# Altium project RD_PCB.PrjPcb
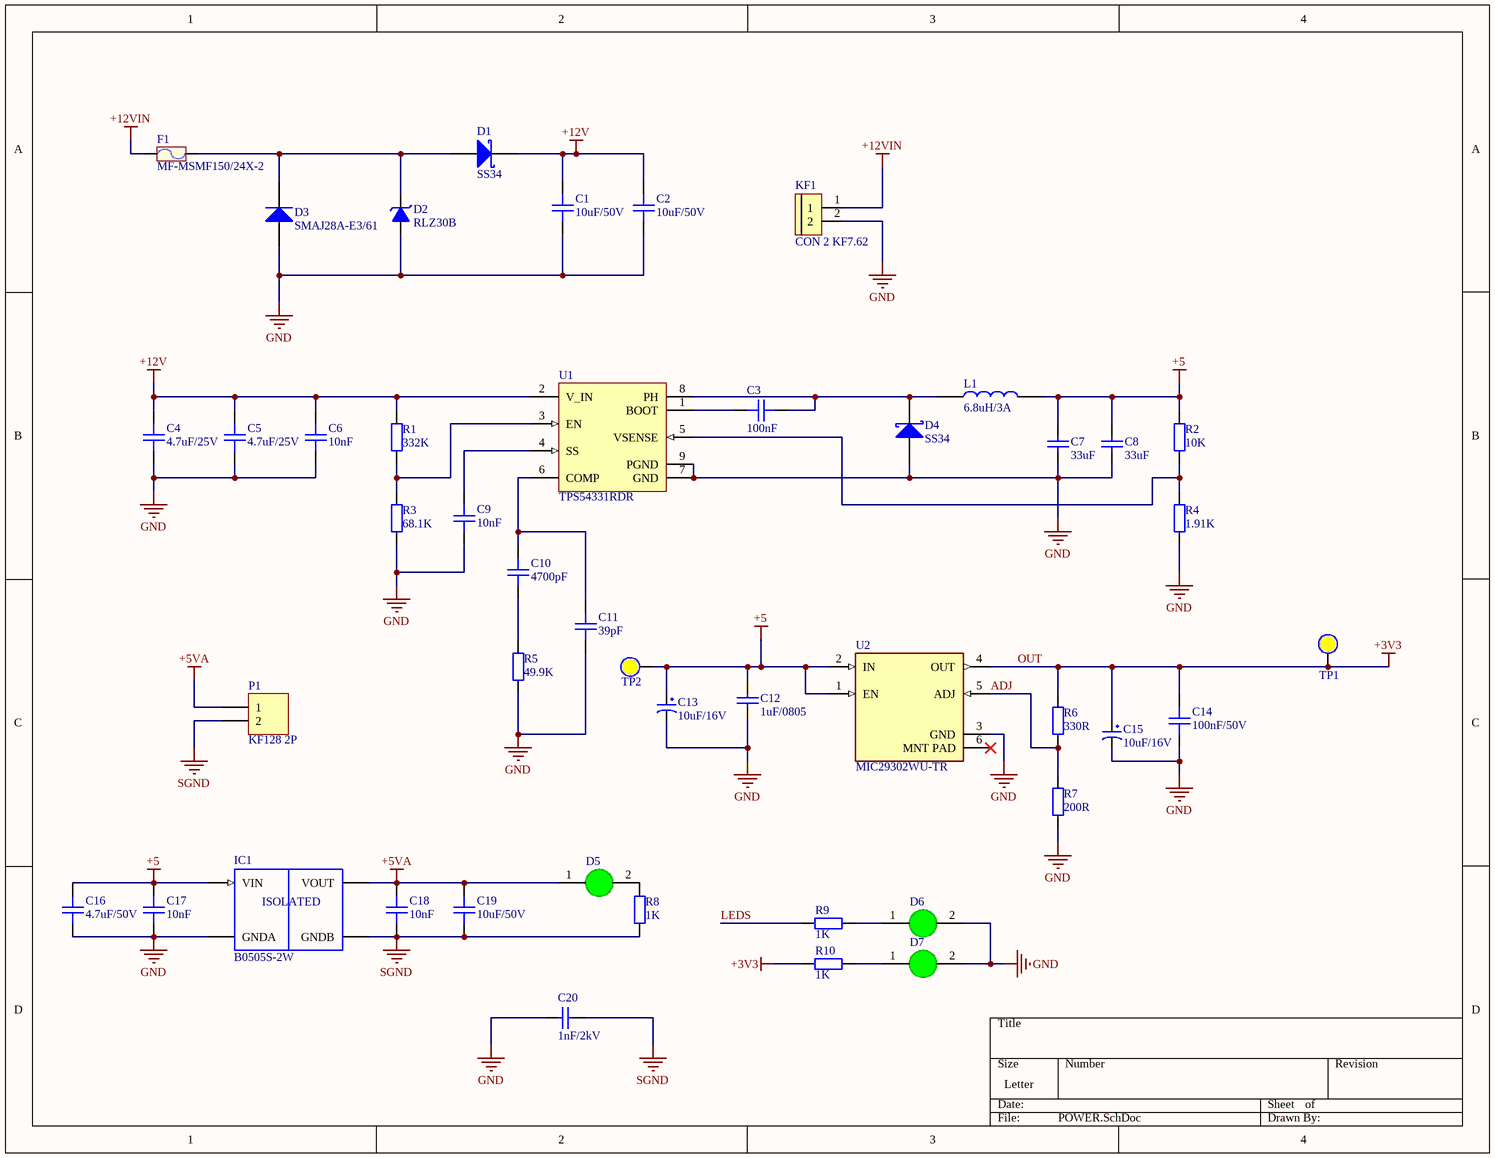
[diagram p0: POWER.SchDoc]
4 sheets, 123 parts. Net scope: global (net labels, ports and power ports of the same name join across sheets).
Board file: RD_PCB_TEST.PcbDoc
Sheets:
  POWER.SchDoc
  MCU.SchDoc
  ETHERNET.SchDoc
  OUTPUT.SchDoc

## Sheet POWER.SchDoc
size Letter; SheetNumber: 1; SheetTotal: 4

### Parts
C1  10uF/50V  [1210]
C2  10uF/50V  [1210]
C3  100nF  [CAPC-0603 (1608)]
C4  4.7uF/25V  [CAPC-1210 (3225)]
C5  4.7uF/25V  [CAPC-1210 (3225)]
C6  10nF  [CAPC-0603 (1608)]
C7  33uF  [tu 1206]
C8  33uF  [tu 1206]
C9  10nF  [CAPC-0603 (1608)]
C10  4700pF  [CAPC-0603 (1608)]
C11  39pF  [CAPC-0603 (1608)]
C12  1uF/0805  [tu 0805]
C13  10uF/16V  [2312]
C14  100nF/50V  [C0805]
C15  10uF/16V  [2312]
C16  4.7uF/50V  [CAPC-0805 (2012)]
C17  10nF  [CAPC-0603 (1608)]
C18  10nF  [CAPC-0603 (1608)]
C19  10uF/50V  [CAPC-0805 (2012)]
C20  1nF/2kV  [tu 1206]
D1  SS34  [DIODE_DO214AC_SMA]
D2  RLZ30B  [SOD_80]
D3  SMAJ28A-E3/61  [VISH-DO-214AC-2_L]
D4  SS34  [DIODE_DO214AC_SMA]
D5  (no value)  [LED_0805_GREEN]
D6  (no value)  [LED_0805_GREEN]
D7  (no value)  [LED_0805_GREEN]
F1  MF-MSMF150/24X-2  [1812]
IC1  B0505S-2W  [B0505S-2W]
KF1  CON 2 KF7.62  [CON 2 KF7.62]
L1  6.8uH/3A  [Cuon Cam 12x12x10]
P1  KF128 2P  [KF128_2P]
R1  332K  [RESC-0603 (1608)]
R2  10K  [RESC-0805 (2012)]
R3  68.1K  [RESC-0603 (1608)]
R4  1.91K  [RESC-0805 (2012)]
R5  49.9K  [RESC-0603 (1608)]
R6  330R  [RESC-0805 (2012)]
R7  200R  [RESC-0805 (2012)]
R8  1K  [RESC-0805 (2012)]
R9  1K  [RESC-0805 (2012)]
R10  1K  [RESC-0805 (2012)]
TP1  (no value)  [Test Point 1 MM]  (no BOM)
TP2  (no value)  [Test Point 1 MM]  (no BOM)
U1  TPS54331RDR  [SOIC-8-TP]
U2  MIC29302WU-TR  [FP-C04-012-MFG]

### Nets
+5: C7.1 C8.1 C12.1 C13.1 C16.2 C17.2 IC1.VIN L1.2 R2.2 TP2.0 U2.1(EN) U2.2(IN)
+5VA: C18.2 C19.2 D5.1(A) IC1.VOUT P1.1
+12V: C1.2 C2.2 C4.2 C5.2 C6.2 D1.2(K) R1.2 U1.2(V_IN)  [project net +LED]
+12VIN: F1.1 KF1.1
GND: C1.1 C2.1 C4.1 C5.1 C6.1 C7.2 C8.2 C9.1 C11.1 C12.2 C13.2 C14.1 C15.2 C16.1 C17.1 C20.2 D2.1(A) D3.2(A) D4.1(A) D6.2(K) D7.2(K) IC1.GNDA KF1.2 R3.1 R4.1 R5.1 R7.1 U1.7(GND) U1.9(PGND) U2.3(GND)
OUT: C14.2 C15.1 R6.2 R10.1 TP1.0 U2.4(OUT)  [also labelled +3V3]
SGND: C18.1 C19.1 C20.1 IC1.GNDB P1.2 R8.2
ADJ: R6.1 R7.2 U2.5(ADJ)
LEDS: R9.1
NetC3_1: C3.1 U1.1(BOOT)
NetC3_2: C3.2 D4.2(K) L1.1 U1.8(PH)
NetC9_2: C9.2 U1.4(SS)
NetC10_1: C10.1 R5.2
NetC10_2: C10.2 C11.2 U1.6(COMP)
NetD1_1: D1.1(A) D2.2(K) D3.1(K) F1.2
NetD5_2: D5.2(K) R8.1
NetD6_1: D6.1(A) R9.2
NetD7_1: D7.1(A) R10.2
NetR1_1: R1.1 R3.2 U1.3(EN)
NetR2_1: R2.1 R4.2 U1.5(VSENSE)

Not connected (* = marked no-connect by the designer): U2 6(MNT_PAD)*

### Notes on the sheet
- (in symbol B0505S-2W) ISOLATED

### Library data of the parts
C1 C2 = CAP_CER_1210_10uF: CAP CER 10uF/50V 1210; Manufacturer: Yageo; Part number: C1210; Cost: 3400; ComponentLink1Description: Link product; ComponentLink1URL: https://www.thegioiic.com/tu-gom-1210-10uf-50v; Package: 1210
C3 = CC0603ZRY5V9BB224: CAP CER 0.22UF 50V Y5V 0603; Value: 224/50V; Solder: SMT; MPN: CC0603ZRY5V9BB224; Category: CAPACITOR; PinCount: 2
C4 C5 = CC1210KKX7R9BB105: CAP CER 1UF 50V X7R 1210; MFR: Yageo; Value: 105/50V; Solder: SMT; MPN: CC1210KKX7R9BB105; Category: CAPACITOR; PinCount: 2
C6 C9 C17 C18 = CC0603KRX7R7BB103: CAP CER 10nF 16V 10% X7R 0603; CompanyID: VT-00592; Solder: SMT; Value: 103/16V; MPN: CC0603KRX7R7BB103; Category: CAPACITOR; PinCount: 2
C7 C8 = Tu 1206 100pF 50V 5%: Dán; Don_Vi: Con; So_Chan: 2; Ten_Linh_Kien: Tụ 1206 100P 5% 50V; Ma_Hang: MH008101; Chung_Loai: Dán; Kieu_Chan: *
C10 = CC0603KRX7R9BB822: CAP CER 8200PF 50V X7R 0603; MFR: Yageo; Value: 822/50V; Solder: SMT; MPN: CC0603KRX7R9BB822; Category: CAPACITOR; PinCount: 2
C11 = CC0603JRNPO9BN560: CAP CER 56PF 50V 5% COG/NPO 0603; Solder: SMT; CompanyID: VT-00150; Value: 56pF/50V; MPN: CC0603JRNPO9BN560; Category: CAPACITOR; PinCount: 2
C12 = Tu 0805 104 50V 10%: Dán; Don_Vi: Con; So_Chan: 2; Ten_Linh_Kien: Tụ 0805 104-100nF 10% 50V; Ma_Hang: MH004551; Chung_Loai: Dán; Kieu_Chan: *; ComponentLink1Description: New link; ComponentLink1URL: https://www.thegioiic.com/tu-gom-0805-1uf-25v
C13 C15 = CAP_TANT_2312_100uF: CAP TANT 100uF/10V 2312; Manufacturer: AVX; Part number: TAJC107K010RNJ; Cost: 5000; ComponentLink1Description: Link product; ComponentLink1URL: https://www.thegioiic.com/tu-tantalum-100uf-10v-2312-tajc107k010rnj; Package: 2312
C14 = CAP_CER_0805_100nF: CAP CER 100nF/50V 0805; Manufacturer: Samsung; Cost: 190; Part number: C0805; ComponentLink1Description: Link product; ComponentLink1URL: https://www.thegioiic.com/tu-gom-0805-100nf-0-1uf-50v; Package: 0805
C16 = CC0805ZRY5V6BB475: CAP CER 4.7uF -20% +80% 10V Y5V 0805; Value: 475/10V; Solder: SMT; CompanyID: VT-01178; MPN: CC0805ZRY5V6BB475; Category: CAPACITOR; PinCount: 2
C19 = CC0805MKX5R6BB226: CAP CER 22uF 20% 10V X5R 0805; Solder: SMT; Value: 226/10V; CompanyID: VT-01177; MPN: CC0805MKX5R6BB226; Category: CAPACITOR; PinCount: 2
C20 = Tu 1206 470pF 50V 10%: Dán; Don_Vi: Con; So_Chan: 2; Ten_Linh_Kien: Tụ 1206 470P 10% 50V; Ma_Hang: MH004548; Chung_Loai: Dán; Kieu_Chan: *
D1 D4 = SS34: DIODE SCHOTTKY 40V 3A SMA; Solder: SMT; MPN: SS34; Value: SS34; MFR: *
D2 = DIO_ZMM15: ZMM15 15V 500mW SMD SOD-80; Manufacturer: On Semiconductor; Cost: 250; Part number: ZMM15; Package: SOD-80 2L; ComponentLink1Description: Link product; ComponentLink1URL: https://www.thegioiic.com/rlz30b-diode-zener-27-70-29-13v-500mw-smd
D3 = VISH-K1A2-2: Transient Voltage Suppressor, 6.40 to 231 V, 28 V Stand-off Voltage, Uni-Directional, -55 to 155 degC, 2-pin DO-214AC, Pb-Free, Tape and Reel; Manufacturer: Vishay Semiconductor; IFSM: 40 A; VBR Uni-Directional (V): 6.4 to 231; ID (uA): 1; VWM (V): 28; PPPM (W): 400, 300; PackageReference: DO-214AC-2; Packing: Tape and Reel; RoHS: TRUE; PartNumber: SMAJ28A-E3/61; PackageDescription: 2-Pin DO-214AC (SMA), Body 4.245 x 2.665 mm; Mounting Technology: Surface Mount; DatasheetVersion: 12/8/2013; Operating Junction and Storage Temperature Range: -55 to 150 degC; ComponentLink4Description: New link; ComponentLink4URL: https://www.thegioiic.com/smaj28a-e3-61-tvs-diode-28v-45-4v-do214ac
D5-D7 = 17-21/G6C-FM1N2B/3T: LED GREEN CLEAR 2V4 20mA 0805 SMD; Value: 2V4/20mA; CompanyID: VT-00393; Solder: SMT; MPN: 17-21/G6C-FM1N2B/3T
F1 = FUSE_16V_2.5A: MF-MSMF250/16 16V 2.5A1812; Manufacturer: Bourns; Cost: 3000; Part number: 1812; ComponentLink1Description: Link product; ComponentLink1URL: https://www.thegioiic.com/mf-msmf150-24x-2-cau-chi-tu-phuc-hoi-1812-24v-1-5a; Package: 1812
IC1 = B0505S-2W: <h1>B0505S-2W </h1> <br> Is a 5V-5V isolated DC-DC converter <br> Specs: <br>2W (400mA) <H3> note: max 220ÂµF Capacity on rail!</h3> Datasheet: <a href="https://www.mornsun-power.com/uploads/pdf/B_S-2W.pdf">B0505S-2W</a>; Package: None; MF: MORNSUN; Value: *; SnapEDA_Link: https://www.snapeda.com/parts/B0505S-2W/MORNSUN/view-part/586697/?ref=snap; Price: None; MP: B0505S-2W; Availability: Unavailable
KF1 = CON 2 KF7.62: Cắm; Ma_Hang: MH002053; Ten_Linh_Kien: CON 2 KF7.62-2P 7.62MM (Đen Thẳng); Chung_Loai: Cắm; Ghi_Chu: *; Kieu_Chan: *; Don_Vi: Con
L1 = CUON CAM 100uH SMD: Dán; Don_Vi: Con; Ma_Hang: MH003999; Ten_Linh_Kien: Cuộn Cảm 100uH 7x7x4MM CD74; Ma_Hang: *; Kieu_Chan: *; Chung_Loai: Dán
P1 = KF128 2P: Header, 2-Pin, pitch 5.08mm; MPN: KF128-2P; Solder: WAVE
R1 = RC0603FR-07330KL: RES SMD 330K OHM 1% 1/10W 0603; Solder: SMT; CompanyID: VT-01025; MPN: RC0603FR-07330KL; Value: 330K; Category: RESISTOR
R2 = RC0805FR-0710KL: RES SMD 10K OHM 1% 1/8W 0805; CompanyID: VT-00007; Solder: SMT; Value: 10K; MPN: RC0805FR-0710KL; Category: RESISTOR
R3 = RC0603FR-0768KL: RES SMD 68K OHM 1% 1/10W 0603; Solder: SMT; MPN: RC0603FR-0768KL; Value: 68K; Category: RESISTOR
R4 = RC0805FR-071K1L: RES SMD 1.1K OHM 1% 1/8W 0805; Solder: SMT; CompanyID: VT-00993; Value: 1K1; MPN: RC0805FR-071K1L; Category: RESISTOR
R5 = RC0603FR0747KL: RES SMD 47K OHM 1% 1/10W 0603; CompanyID: VT-00322; Solder: SMT; Value: 47K; MPN: RC0603FR0747KL; Category: RESISTOR
R6 = RC0805FR-07330RL: RES SMD 330 OHM 1% 1/8W 0805; CompanyID: VT-00009; Solder: SMT; Value: 330R; MPN: RC0805FR-07330RL; Category: RESISTOR
R7 = RC0805FR-07300RL: RES SMD 300 OHM 1% 1/8W 0805; Solder: SMT; Value: 300R; CompanyID: VT-00929; MPN: RC0805FR-07300RL; Category: RESISTOR
R8-R10 = RC0805FR-071KL: RES SMD 1K OHM 1% 1/8W 0805; Solder: SMT; CompanyID: VT-00024; Value: 1K; MPN: RC0805FR-071KL; Category: RESISTOR
TP1 TP2 = Test Point: Solder: NF
U1 = TPS54360DDAR: Step Down DC-DC Converter; Solder: SMT; MPN: TPS54360DDAR; Value: TPS54360; Category: IC
U2 = CMP-06324-000007-1: IC REG LINEAR POS ADJ 3A TO263-5; Manufacturer: Microchip; Output Voltage: 3.3-12V; Output Type: AdjustableProgrammable; Max Junction Temp: +125°C; Standoff Height: 0mm; Accuracy Percentage: 1%; Max Supply Voltage: 26V; Nominal Supply Current: 10-37mA; Number Of Outputs: 1; Dropout Voltage: 370mV; Min Supply Voltage: 2.25V; Device Class L1: Integrated Circuits (ICs); Digikey Description: IC REG LINEAR POS ADJ 3A TO263-5; Device Class L2: Power Management ICs; Lead Free: Yes; Mouser Description: LDO Voltage Regulators; Package: C04-012; Temperature: -40°C to +125°C; Temperature Range High: +125°C; Automotive: No; Device Class L3: Voltage Regulators - Linear; Category: IC; Temperature Range Low: -40°C; RoHS: TRUE; Output Current: 3A; Octopart: https://octopart.com/mic29302wu-tr-microchip-66801318; Manufacturer Part Number: MIC29302WU-TR; Height: 0.2inch; ComponentLink3Description: New link; ComponentLink3URL: https://www.thegioiic.com/mic29302-ic-dieu-chinh-dien-ap-3a

## Sheet MCU.SchDoc
size A; SheetNumber: 2; SheetTotal: 4
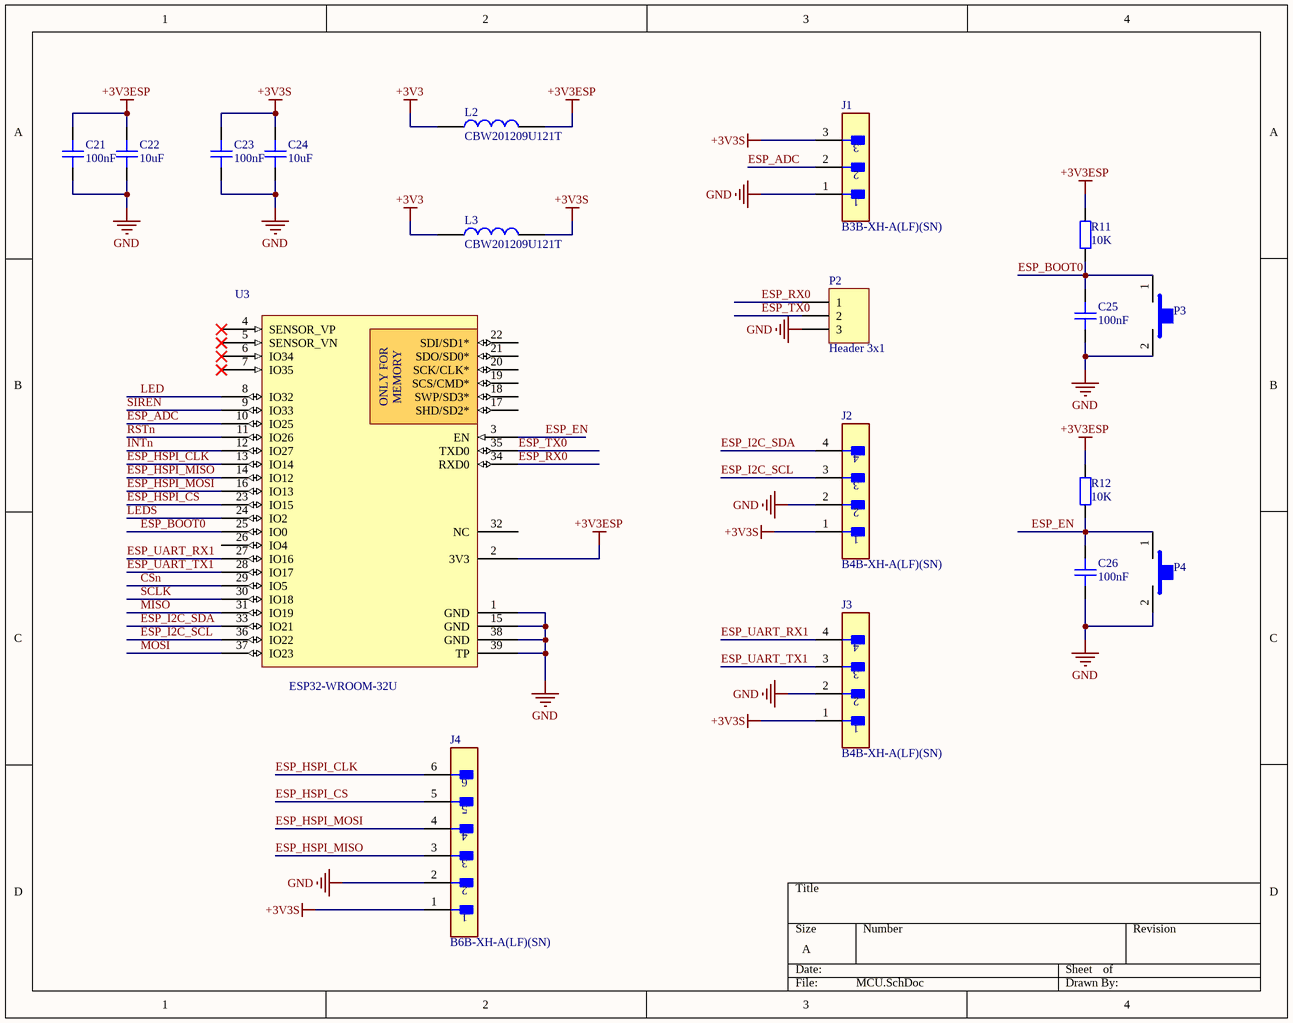
[diagram p1: MCU.SchDoc]

### Parts
C21  100nF  [CAPC-0603 (1608)]
C22  10uF  [CAPC-0603 (1608)]
C23  100nF  [CAPC-0603 (1608)]
C24  10uF  [CAPC-0603 (1608)]
C25  100nF  [CAPC-0603 (1608)]
C26  100nF  [CAPC-0603 (1608)]
J1  B3B-XH-A(LF)(SN)  [FP-B3B-XH-A_LF_SN-MFG]
J2  B4B-XH-A(LF)(SN)  [FP-B4B-XH-A_LF_SN-MFG]
J3  B4B-XH-A(LF)(SN)  [FP-B4B-XH-A_LF_SN-MFG]
J4  B6B-XH-A(LF)(SN)  [FP-B6B-XH-A_LF_SN-MFG]
L2  CBW201209U121T  [IND-0805 (2012)]
L3  CBW201209U121T  [IND-0805 (2012)]
P2  Header 3x1  [HDR1X3]
P3  (no value)  [SW 2P SMD]
P4  (no value)  [SW 2P SMD]
R11  10K  [RESC-0603 (1608)]
R12  10K  [RESC-0603 (1608)]
U3  ESP32-WROOM-32U  [ESP32-WROOM-32U]

### Nets
+3V3: L2.2 L3.2  [project net OUT]
+3V3ESP: C21.2 C22.2 L2.1 R11.2 R12.2 U3.2(3V3)
+3V3S: C23.2 C24.2 J1.3 J2.1 J3.1 J4.1 L3.1
GND: C21.1 C22.1 C23.1 C24.1 C25.1 C26.1 J1.1 J2.2 J3.2 J4.2 P2.3 P3.2 P4.2 U3.1(GND) U3.15(GND) U3.38(GND) U3.39(TP)
CSn: U3.29(IO5)
ESP_ADC: J1.2 U3.10(IO25)
ESP_BOOT0: C25.2 P3.1 R11.1 U3.25(IO0)
ESP_EN: C26.2 P4.1 R12.1 U3.3(EN)
ESP_HSPI_CLK: J4.6 U3.13(IO14)
ESP_HSPI_CS: J4.5 U3.23(IO15)
ESP_HSPI_MISO: J4.3 U3.14(IO12)
ESP_HSPI_MOSI: J4.4 U3.16(IO13)
ESP_I2C_SCL: J2.3 U3.36(IO22)
ESP_I2C_SDA: J2.4 U3.33(IO21)
ESP_RX0: P2.1 U3.34(RXD0)
ESP_TX0: P2.2 U3.35(TXD0)
ESP_UART_RX1: J3.4 U3.27(IO16)
ESP_UART_TX1: J3.3 U3.28(IO17)
INTn: U3.12(IO27)
LED: U3.8(IO32)
LEDS: U3.24(IO2)
MISO: U3.31(IO19)
MOSI: U3.37(IO23)
RSTn: U3.11(IO26)
SCLK: U3.30(IO18)
SIREN: U3.9(IO33)

Not connected (* = marked no-connect by the designer): U3 4(SENSOR_VP)* 5(SENSOR_VN)* 6(IO34)* 7(IO35)* 17(SHD/SD2*) 18(SWP/SD3*) 19(SCS/CMD*) 20(SCK/CLK*) 21(SDO/SD0*) 22(SDI/SD1*) 26(IO4) 32(NC)

### Notes on the sheet
- (in symbol ESP32-WROOM-32U) ONLY FOR; MEMORY

### Library data of the parts
C21 C23 = CC0603KRX7R7BB105: CAP CER 1uF 10% 16V X7R 0603; Value: 105/16V; CompanyID: VT-00017; Solder: SMT; MPN: CC0603KRX7R7BB105; Category: CAPACITOR; PinCount: 2
C22 C24 = CC0603JRX7R9BB183: CAP CER 0.018UF 50V X7R 0603; MFR: Yageo; Value: 183/50V; Solder: SMT; MPN: CC0603JRX7R9BB183; Category: CAPACITOR; PinCount: 2
C25 C26 = CC0603ZRY5V9BB224: as C3 on sheet POWER; MPN: CC0603ZRY5V9BB224; Category: CAPACITOR; PinCount: 2
J1 = CMP-17439-000014-3: CONN HEADER VERT 3POS 2.5MM; Max Voltage Rating (DC): 250V; Number of Positions: 3; Current Rating: 3A; Gender: Male; Wire/Cable Gauge: 22AWG; Contact Resistance: 20mR; Insulation Resistance: 1GR; Insulation Material: Nylon; Contact Plating: Tin; Depth: 5.75mm; Contact Type: Male Pin; Max Operating Temperature: 85°C; Insulation Color: Natural; Voltage Rating (AC): 250V; Color: Natural; Connector Type: Header; Orientation: Straight; Fastening Type: Detent; Housing Color: White; Min Operating Temperature: -25°C; Termination: Solder; Voltage Rating: 250V; Series: XH; Pitch: 2.5mm; Contact Shape: Square; Number of Rows: 1; Lead Free: Lead Free; Packaging: Bulk; Mount: Through Hole; Flammability Rating: UL94 V-0; Max Voltage Rating (AC): 250V; REACH SVHC: No SVHC; Housing Material: Polyamide; Contact Material: Brass; Lead Pitch: 2.5mm; Contact Finish - Mating: TIN; Length: 9.9mm; Max Current Rating: 3A; Number of Contacts: 3
J2 J3 = CMP-17439-000250-1: CONN HEADER VERT 4POS 2.5MM; Number of Contacts: 4; Contact Resistance: 20mR; Voltage Rating: 250V; Max Current Rating: 3A; Gender: Male; Wire/Cable Gauge: 22AWG; Mated Stacking Heights: 9.8mm; Insulation Resistance: 1GR; Orientation: Straight; Contact Type: Male Pin; Contact Finish - Mating: TIN; Series: XH; Max Voltage Rating (AC): 250V; Lead Pitch: 2.5mm; Contact Shape: Square; Insulation Color: Natural; Termination: Solder; Lead Free: Lead Free; Voltage Rating (AC): 250V; Number of Rows: 1; Flammability Rating: UL94 V-0; Number of Positions: 4; Max Operating Temperature: 85°C; Package Quantity: 500; Mount: Through Hole; REACH SVHC: No SVHC; Connector Type: Header; Insulation Material: Nylon; Fastening Type: Detent; Min Operating Temperature: -25°C; Housing Color: White; Packaging: Bulk; Contact Plating: Tin; Contact Material: Brass; Max Voltage Rating (DC): 250V; Housing Material: Polyamide; Color: Natural; Material: Polyamide; Pitch: 2.5mm; Depth: 5.75mm; Current Rating: 3A; Length: 12.4mm
J4 = CMP-17439-000076-1: CONN HEADER VERT 6POS 2.5MM
L2 L3 = MPZ2012S221A: IND-FERRITE BEAD 220 OHM 0805 1LN; CompanyID: VT-00253; Solder: SMT; Value: 220OHM/3A; MPN: MPZ2012S221A; Category: FERRITE BEAD; PinCount: 2
P2 = Header 3x1: Header, 3-Pin, pitch 2.54mm; Solder: WAVE
P3 P4 = Button 2 SMD: SMD Mini Push Button Switch 2 Pin 3x6x2.7mm; MPN: SMD Mini Push Button 2 SMD; Link: https://ram-e-shop.com/product/press2pin-smd/
R11 R12 = RC0603FR-0710KL: RES SMD 10K OHM 1% 1/10W 0603; CompanyID: VT-00328; Solder: SMT; MPN: RC0603FR-0710KL; Value: 10K; Category: RESISTOR
U3 = ESP32-WROOM-32U: Wi-Fi/BT BLE Module ESP32-D0WD; MFR: Espressif; Solder: SMT; Price: None; Value: ESP32-WROOM-32U; Category: MODULE; MPN: ESP32-WROOM-32U; PinCount: 40

## Sheet ETHERNET.SchDoc
size B; SheetNumber: 3; SheetTotal: 4
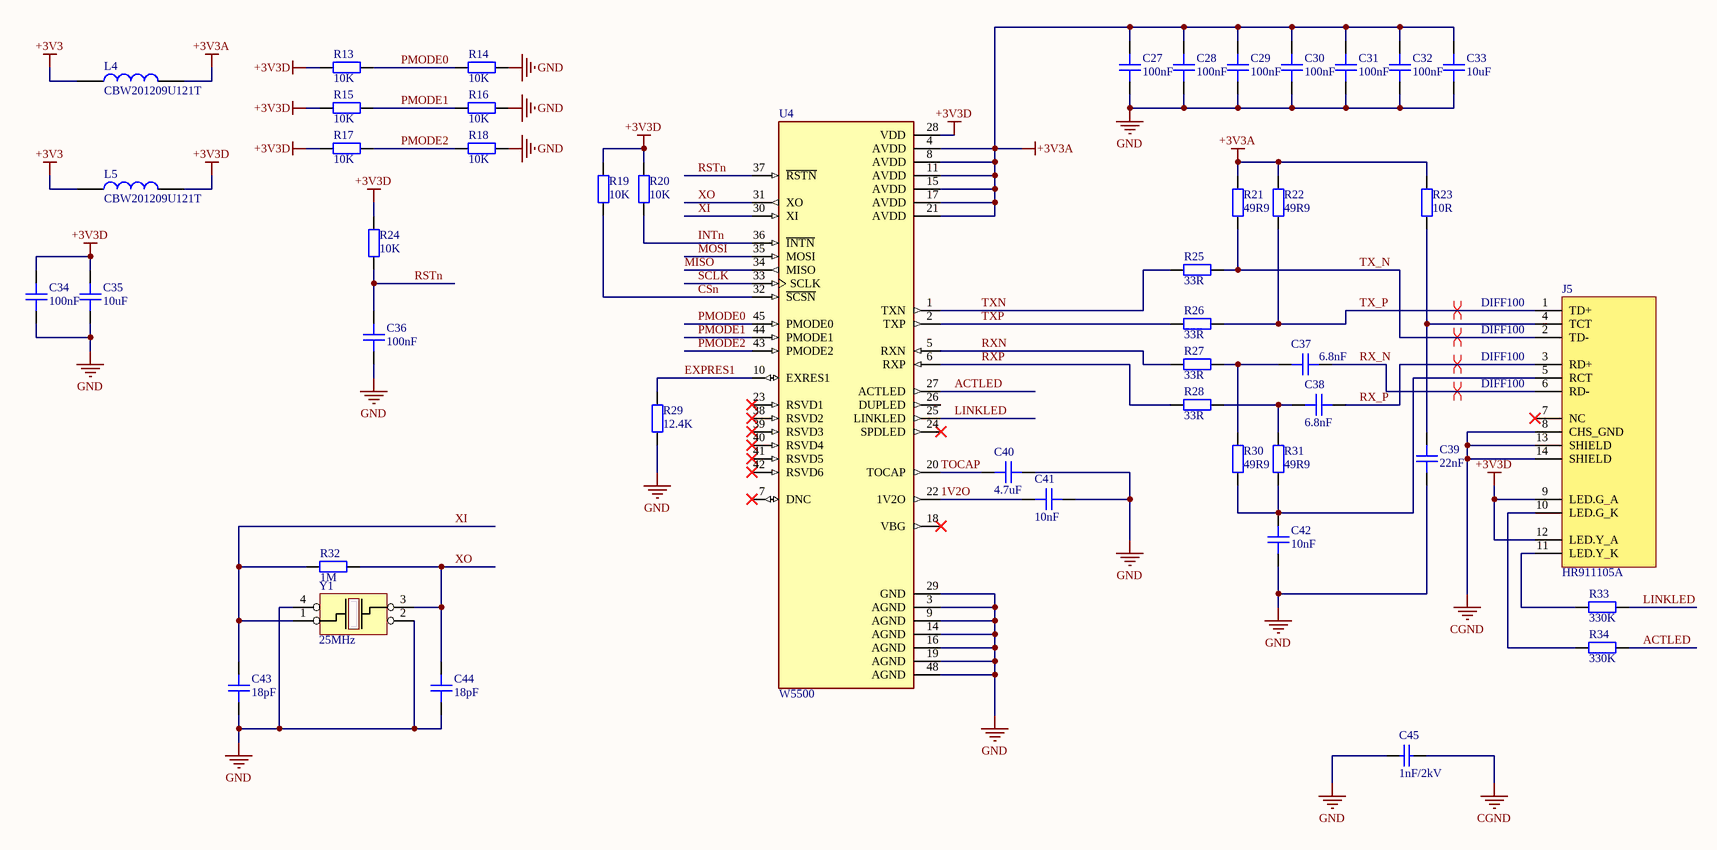
[diagram p2: ETHERNET.SchDoc]

### Parts
C27  100nF  [CAPC-0603 (1608)]
C28  100nF  [CAPC-0603 (1608)]
C29  100nF  [CAPC-0603 (1608)]
C30  100nF  [CAPC-0603 (1608)]
C31  100nF  [CAPC-0603 (1608)]
C32  100nF  [CAPC-0603 (1608)]
C33  10uF  [CAPC-0603 (1608)]
C34  100nF  [CAPC-0603 (1608)]
C35  10uF  [CAPC-0603 (1608)]
C36  100nF  [CAPC-0603 (1608)]
C37  6.8nF  [CAPC-0603 (1608)]
C38  6.8nF  [CAPC-0603 (1608)]
C39  22nF  [CAPC-0603 (1608)]
C40  4.7uF  [CAPC-0603 (1608)]
C41  10nF  [CAPC-0603 (1608)]
C42  10nF  [CAPC-0603 (1608)]
C43  18pF  [CAPC-0603 (1608)]
C44  18pF  [CAPC-0603 (1608)]
C45  1nF/2kV  [tu 1206]
J5  HR911105A  [HR911105A]
L4  CBW201209U121T  [IND-0805 (2012)]
L5  CBW201209U121T  [IND-0805 (2012)]
R13  10K  [RESC-0603 (1608)]
R14  10K  [RESC-0603 (1608)]
R15  10K  [RESC-0603 (1608)]
R16  10K  [RESC-0603 (1608)]
R17  10K  [RESC-0603 (1608)]
R18  10K  [RESC-0603 (1608)]
R19  10K  [RESC-0603 (1608)]
R20  10K  [RESC-0603 (1608)]
R21  49R9  [RESC-0603 (1608)]
R22  49R9  [RESC-0603 (1608)]
R23  10R  [RESC-0603 (1608)]
R24  10K  [RESC-0603 (1608)]
R25  33R  [RESC-0603 (1608)]
R26  33R  [RESC-0603 (1608)]
R27  33R  [RESC-0603 (1608)]
R28  33R  [RESC-0603 (1608)]
R29  12.4K  [RESC-0603 (1608)]
R30  49R9  [RESC-0603 (1608)]
R31  49R9  [RESC-0603 (1608)]
R32  1M  [RESC-0603 (1608)]
R33  330K  [RESC-0603 (1608)]
R34  330K  [RESC-0603 (1608)]
U4  W5500  [QFP50P900X900X160-48N]
Y1  25MHz  [CRYSTALL_SMD_3225]

### Nets
+3V3: L4.2 L5.1  [project net OUT]
+3V3A: C27.2 C28.2 C29.2 C30.2 C31.2 C32.2 C33.2 L4.1 R21.2 R22.2 R23.2 U4.4(AVDD) U4.8(AVDD) U4.11(AVDD) U4.15(AVDD) U4.17(AVDD) U4.21(AVDD)
+3V3D: C34.2 C35.2 J5.9(LED.G_A) J5.12(LED.Y_A) L5.2 R13.1 R15.1 R17.1 R19.2 R20.2 R24.2 U4.28(VDD)
CGND: C45.1 J5.8(CHS_GND) J5.13(SHIELD) J5.14(SHIELD)
GND: C27.1 C28.1 C29.1 C30.1 C31.1 C32.1 C33.1 C34.1 C35.1 C36.1 C39.1 C40.2 C41.2 C42.1 C43.1 C44.1 C45.2 R14.2 R16.2 R18.2 R29.1 U4.3(AGND) U4.9(AGND) U4.14(AGND) U4.16(AGND) U4.19(AGND) U4.29(GND) U4.48(AGND) Y1.2 Y1.4
1V2O: C41.1 U4.22(1V2O)
ACTLED: R34.2 U4.27(ACTLED)
CSn: R19.1 U4.32(~{SCSN})
EXPRES1: R29.2 U4.10(EXRES1)
INTn: R20.1 U4.36(~{INTN})
LINKLED: R33.2 U4.25(LINKLED)
MISO: U4.34(MISO)
MOSI: U4.35(MOSI)
PMODE0: R13.2 R14.1 U4.45(PMODE0)
PMODE1: R15.2 R16.1 U4.44(PMODE1)
PMODE2: R17.2 R18.1 U4.43(PMODE2)
RSTn: C36.2 R24.1 U4.37(~{RSTN})
RX_N: C37.2 J5.6(RD-)
RX_P: C38.2 J5.3(RD+)
RXN: R27.1 U4.5(RXN)
RXP: R28.1 U4.6(RXP)
SCLK: U4.33(SCLK)
TOCAP: C40.1 U4.20(TOCAP)
TX_N: J5.2(TD-) R21.1 R25.2
TX_P: J5.1(TD+) R22.1 R26.2
TXN: R25.1 U4.1(TXN)
TXP: R26.1 U4.2(TXP)
XI: C43.2 R32.1 U4.30(XI) Y1.1
XO: C44.2 R32.2 U4.31(XO) Y1.3
NetC37_1: C37.1 R27.2 R30.2
NetC38_1: C38.1 R28.2 R31.2
NetC39_2: C39.2 J5.4(TCT) R23.1
NetC42_2: C42.2 J5.5(RCT) R30.1 R31.1
NetJ5_10: J5.10(LED.G_K) R34.1
NetJ5_11: J5.11(LED.Y_K) R33.1

Not connected (* = marked no-connect by the designer): J5 7(NC)*; U4 7(DNC)* 18(VBG)* 23(RSVD1)* 24(SPDLED)* 26(DUPLED) 38(RSVD2)* 39(RSVD3)* 40(RSVD4)* 41(RSVD5)* 42(RSVD6)*

### Layout directives
differential pair; net class DIFF100: TX_N
differential pair; differential pair class DIFF100: RX_N, RX_P, TX_P

### Library data of the parts
C27-C32 C34 C36 = CC0603KRX7R7BB105: as C21 on sheet MCU; MPN: CC0603KRX7R7BB105; Category: CAPACITOR; PinCount: 2
C33 C35 = CC0603JRX7R9BB183: as C22 on sheet MCU; MPN: CC0603JRX7R9BB183; Category: CAPACITOR; PinCount: 2
C37 C38 = CC0603JRX7R9BB682: CAP CER 6.8nF 5% 50V X7R 0603; CompanyID: VT-00669; Solder: SMT; Value: 682/50V; MPN: CC0603JRX7R9BB682; Category: CAPACITOR; PinCount: 2
C39 = CC0603KRX7R7BB224: CAP CER 0.22UF 16V X7R 0603; MFR: Yageo; Value: 224/16V; Solder: SMT; MPN: CC0603KRX7R7BB224; Category: CAPACITOR; PinCount: 2
C40 = CC0603JRNPO9BN471: CAP CER 470pF 50V 5% C0G/NPO 0603; Value: 471/50V; Solder: SMT; CompanyID: VT-01332; MPN: CC0603JRNPO9BN471; Category: CAPACITOR; PinCount: 2
C41 C42 = CC0603KRX7R7BB103: as C6 on sheet POWER; MPN: CC0603KRX7R7BB103; Category: CAPACITOR; PinCount: 2
C43 C44 = CC0603JRNPO9BN181: CAP CER 180PF 50V 5% COG/NPO 0603; Solder: SMT; CompanyID: VT-01337; Value: 181/50V; MPN: CC0603JRNPO9BN181; Category: CAPACITOR; PinCount: 2
C45 = Tu 1206 470pF 50V 10%: as C20 on sheet POWER; Chung_Loai: Dán; Kieu_Chan: *
J5 = HR911105A: Hanrun HR911105A RJ-45 Connector; Solder: WAVE; MPN: HR911105A; MFR: HanRun; Value: HR911105A
L4 L5 = MPZ2012S221A: as L2 on sheet MCU; MPN: MPZ2012S221A; Category: FERRITE BEAD; PinCount: 2
R13-R20 R24 = RC0603FR-0710KL: as R11 on sheet MCU; MPN: RC0603FR-0710KL; Value: 10K; Category: RESISTOR
R21 R22 R30 R31 = RC0603FR-0749R9L: RES SMD 49.9 OHM 1% 1/10W 0603; MFR: Yageo; Solder: SMT; MPN: RC0603FR-0749R9L; Value: 49R9; Category: RESISTOR; PinCount: 2
R23 = RC0603FR-0710RL: RES SMD 10 OHM 1% 1/10W 0603; CompanyID: VT-00865; Solder: SMT; MPN: RC0603FR-0710RL; Value: 10R; Category: RESISTOR
R25-R28 = RC0603FR-0733RL: RES SMD 33 OHM 1% 1/10W 0603; MFR: Yageo; Solder: SMT; MPN: RC0603FR-0733RL; Value: 33R; Category: RESISTOR
R29 = RC0603FR-0712KL: RES SMD 12KOHM 1% 1/10W 0603; Solder: SMT; Value: 12K; CompanyID: *; MPN: RC0603FR-0712KL; Category: RESISTOR
R32 = RC0603FR-0710ML: RES SMD 10M OHM 1% 1/10W 0603; Solder: SMT; MPN: RC0603FR-0710ML; Value: 10M; Category: RESISTOR
R33 R34 = RC0603FR-07330KL: as R1 on sheet POWER; MPN: RC0603FR-07330KL; Value: 330K; Category: RESISTOR
U4 = W5500: Hardwired TCP/IP embedded Ethernet controller; Availability: Unavailable; MP: W5500; Value: *; Price: None; Package: None
Y1 = ABM8G-25.000MHZ-18-D2Y-T: CRYSTAL 25.0000MHZ 18PF SMD; MFR: Abracon LLC; Solder: SMT; CompanyID: VT-xxx; MPN: ABM8G-25.000MHZ-18-D2Y-T; Value: 25MHz; Category: CRYSTAL

## Sheet OUTPUT.SchDoc
size A; SheetNumber: 4; SheetTotal: 4
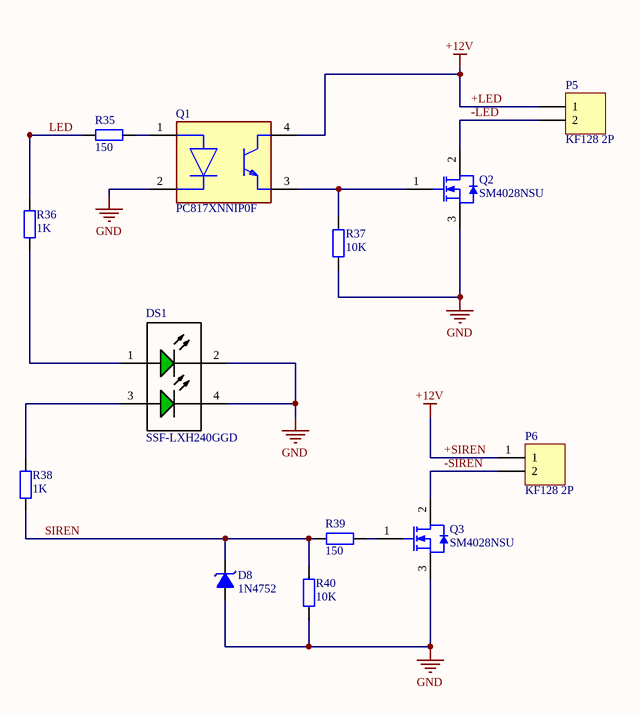
[diagram p3: OUTPUT.SchDoc]

### Parts
D8  1N4752  [DIODE ZENNER SMD SOD80]
DS1  SSF-LXH240GGD  [LUMX-SSF-LXH240GGD_V]
P5  KF128 2P  [KF128_2P]
P6  KF128 2P  [KF128_2P]
Q1  PC817XNNIP0F  [FP-PC817XNNIP0F-MFG]
Q2  SM4028NSU  [INF-PG-TO252-3-313_L]
Q3  SM4028NSU  [INF-PG-TO252-3-313_L]
R35  150  [tro smd 0805]
R36  1K  [tro smd 0805]
R37  10K  [tro smd 0805]
R38  1K  [tro smd 0805]
R39  150  [tro smd 0805]
R40  10K  [tro smd 0805]

### Nets
+LED: P5.1 P6.1 Q1.4(C)  [also labelled +12V, +SIREN]
GND: D8.1(A) DS1.2(K) DS1.4(K) Q1.2(C) Q2.3(SOURCE) Q3.3(SOURCE) R37.2 R40.2
-LED: P5.2 Q2.2(DRAIN)
-SIREN: P6.2 Q3.2(DRAIN)
LED: R35.2 R36.2
SIREN: D8.2(K) R38.1 R39.2 R40.1
NetDS1_1: DS1.1(A) R36.1
NetDS1_3: DS1.3(A) R38.2
NetQ1_1: Q1.1(A) R35.1
NetQ1_3: Q1.3(E) Q2.1(GATE) R37.1
NetQ3_1: Q3.1(GATE) R39.1

### Library data of the parts
D8 = Diode Zener 15V: Dán; Don_Vi: Con; Ma_Hang: MH002883; Ten_Linh_Kien: Diode Zener 1/2W 15V SMD1206 ZMM15; Ghi_Chu: *; Chung_Loai: Dán; Kieu_Chan: *; ComponentLink1Description: New link; ComponentLink1URL: https://www.thegioiic.com/zmm24-diode-zener-24v-500mw-smd
DS1 = CMP-2000-07152-1: LED, Green, 105 mW, 2.2 V, -40 to 85 degC, 4-Pin THD, RoHD, Bulk; Manufacturer: Lumex; Pin_Count: 4; Number of LEDs: 2; Intensity: 30mcd; Lens Appearance: ColoredDiffused; LED Material: GaP; Type: Bi-LevelUni-Color; Reverse Voltage: 5(Min)V; Viewing Angle: 60; Peak Wavelength: 565nm; Dimension: 12.58x10.77x9.65mm; Color: Green; Operating Temperature: N/A; Mounting Technology: ThroughHole; Datasheet Version: Rev. H, 03/2001; Manufacturer URL: http://www.lumexinstruments.com/; Part No: SSF-LXH240GGD; Supplier_Package: N/A; Packaging: N/A; Family: SSF-LXH240GGD; ECCN: EAR99; Mounting: ThroughHole; Lens Dimensions: 2.9x2.9x2.64mm; HTS: 8541402000; Dominant Wavelength: N/A; Package Reference: SSF-LXH240GGD; RoHS: Unknown; Supplier: Lumex; Datasheet URL: http://www.lumex.com/content/files/ProductAttachment/SSF-LXH240GGD.pdf; Package Description: 4-Pin Through Hole Device, Body 10.77 x 4.32 mm, Pitch 2.54 mm
P5 P6 = KF128 2P: as P1 on sheet POWER
Q1 = CMP-65434-000005-1: OPTOISOLATOR 5KV TRANS 4SMD; Reverse Breakdown Voltage: 6V; Output Current per Channel: 30mA; Power Dissipation: 200mW; Collector-emitter Voltage-Max: 200mV; Max Output Voltage: 80V; Input Current: 50mA; Forward Voltage: 1.4V; Fall Time: 18000ns; Number of Elements: 1; Input Type: DC; Packaging: Tape and Reel; RoHS Compliant: Yes; Contact Plating: Copper; Min Operating Temperature: -30°C; Collector Emitter Saturation Voltage: 200mV; Max Input Current: 50mA; Radiation Hardening: No; Max Collector Current: 50mA; Case/Package: SMD/SMT; Mount: Surface Mount; Output Voltage: 80V; Forward Current: 50mA; Max Power Dissipation: 200mW; Collector Emitter Voltage (VCEO): 80V; Number of Channels: 1; Rise Time: 18000ns; Isolation Voltage: 5kV; Number of Pins: 4; Lead Free: Lead Free; Package Quantity: 2000; Isolation Voltage-Max: 5kV; Max Operating Temperature: 100°C; ComponentLink1Description: New link; ComponentLink1URL: https://www.thegioiic.com/pc817x2nip0f-optoisolator-transistor-output-5000vrms-1-channel-4-smd
Q2 Q3 = CMP-1164-00349-1: N-Channel CoolMOS E6 Power-Transistor, 600 V VDS, 7.3 A ID, -55 to 150 degC, PG-TO252-3-313, Reel, Green; Manufacturer: Infineon; PartNumber: IPD60R600C6; IDpuls (max): 19Â A; VDS (max): 600Â V; VGS(th) (min): 2.5Â V; Ptot (max): 63Â W; Rth: 2Â K/W; VGS(th) (max): 3.5Â V; QG: 20.5Â nC; Green: TRUE; RDS (on) (max): 600Â mOhm; ID (max): 7.3Â A; RthJA (max): 62Â K/W; Polarity: N; Packing: Reel; PackageVersion: Oct-10; ComponentLink3Description: Package Specification; ComponentLink3URL: http://www.infineon.com/dgdl/PG-TO252-3-313-Package_Overview.pdf?folderId=db3a30432b57a660012b81890ade72d2&fileId=db3a30432b57a660012b8193af2872eb; Mounting Technology: Surface Mount; Technology: CoolMOS C6; PackageDescription: 3-Pin Plastic (Green) Transistor Single Outline Package, 6.5 x 6.12 mm Body, 2.28 mm Pitch; ComponentLink2Description: Datasheet; RthJC (max): 2Â K/W; ComponentLink1Description: Manufacturer URL; ComponentLink1URL: http://www.infineon.com/; ComponentLink2URL: http://www.infineon.com/dgdl/IPD60R600C6_2_0.pdf?folderId=db3a30431ff98815012019af55de3f2c&fileId=db3a30432239cccd0122a83152b97d6f; PackageReference: PG-TO252-3-313; DatasheetVersion: Rev. 2.0
R35-R40 = Tro 0603 5% 10k: Dán; Don_Vi: Con; So_Chan: 2; Ten_Linh_Kien: Trở 0603 5% 10k; Ma_Hang: MH006316; Chung_Loai: Dán; Kieu_Chan: *; ComponentLink1Description: New link; ComponentLink1URL: https://www.thegioiic.com/dien-tro-1-kohm-0603-1; ComponentLink2Description: New link; ComponentLink2URL: 2300

## Nets that join several sheets
+LED: POWER (8 pins), OUTPUT (P5.1 P6.1 Q1.4)
GND: POWER (30 pins), MCU (17 pins), ETHERNET (30 pins), OUTPUT (8 pins)
OUT: POWER (6 pins), MCU (L2.2 L3.2), ETHERNET (L4.2 L5.1)
CSn: MCU (U3.29), ETHERNET (R19.1 U4.32)
INTn: MCU (U3.12), ETHERNET (R20.1 U4.36)
LED: MCU (U3.8), OUTPUT (R35.2 R36.2)
LEDS: POWER (R9.1), MCU (U3.24)
MISO: MCU (U3.31), ETHERNET (U4.34)
MOSI: MCU (U3.37), ETHERNET (U4.35)
RSTn: MCU (U3.11), ETHERNET (C36.2 R24.1 U4.37)
SCLK: MCU (U3.30), ETHERNET (U4.33)
SIREN: MCU (U3.9), OUTPUT (D8.2 R38.1 R39.2 R40.1)